# Altium schematic sheet Channel.SchDoc
size A4; SheetNumber: 2; SheetTotal: 2
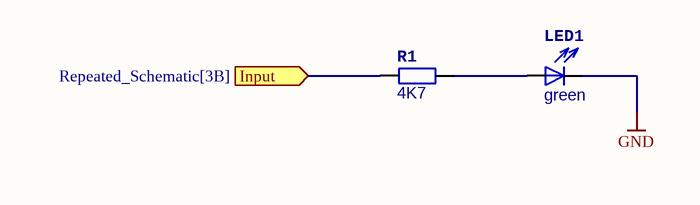
[diagram p0: Channel.SchDoc]

## Parts
LED1  green  [LED0603]
R1  4K7  [R0603]

## Ports
Input (in, see Repeated_Schematic[3B])

## Nets
GND: LED1.C
Input: R1.1 ; port Input
NetLED1_A: LED1.A R1.2

## Library data of the parts
LED1 = LED_0603_GREEN: GREEN LED, 0603, 430mcd, 140°, VF 3.2V, VR 5V; BE-NR: BH-90-00064; TMP: -40°C to +85°C; IF: 30mA; ORDER-NO: 150060GS75000; MNF: WE; COLOR: green; VR: 5V; VF: 3.2V; ComponentLink1Description: datasheet; ComponentLink1URL: https://www.we-online.com/components/products/datasheet/150060GS75000.pdf
R1 = 4K7-0603: 4k7,  1%, TK100, 0.1W; BE-NR: BP-11-00141; FOOTPRINT: 0603